# Altium project CamLink.PrjPcb
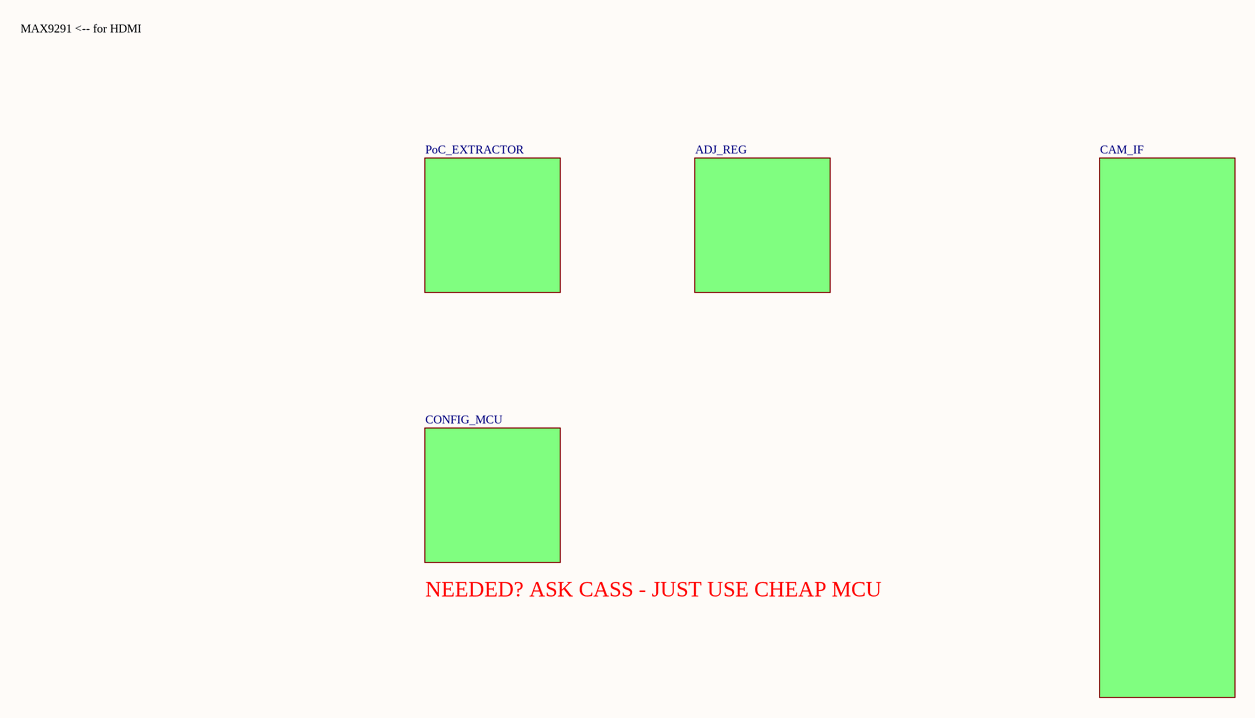
[diagram p0: CamLink.SchDoc]
5 sheets, 3 parts. Net scope: global (net labels, ports and power ports of the same name join across sheets).
Sheets:
  CamLink.SchDoc
    CAM_IF = CAM_IF.SchDoc
    ADJ_REG = ADJ_REG.SchDoc
    PoC_EXTRACTOR = PoC_EXTRACTOR.SchDoc
    CONFIG_MCU = CONFIG_MCU.SchDoc

## Sheet CamLink.SchDoc
size B; SheetNumber: 1; SheetTotal: 5

### Sub-sheets
ADJ_REG = ADJ_REG: no entries
CAM_IF = CAM_IF: no entries
CONFIG_MCU = CONFIG_MCU: no entries
PoC_EXTRACTOR = PoC_EXTRACTOR: no entries

### Notes on the sheet
- MAX9291 <-- for HDMI
- NEEDED? ASK CASS - JUST USE CHEAP MCU

## Sheet CAM_IF.SchDoc
size C; SheetNumber: 2; SheetTotal: 2
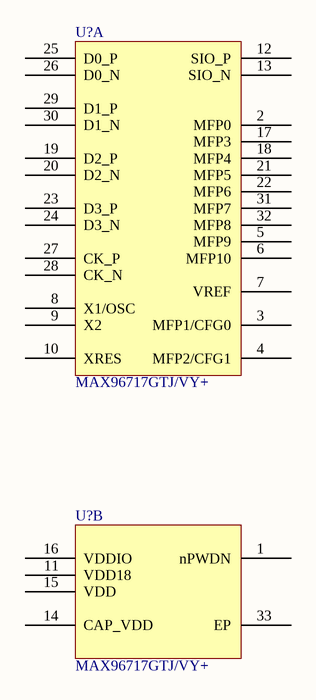
[diagram p1: CAM_IF.SchDoc]

### Parts
(Parts that share a designator on the sheet are numbered #1, #2 ... from top to bottom, then left to right.)
U?#1  MAX96717GTJ/VY+  [PQFN50P500X500X80_HS-33N]  (part A of 2)
U?#2  MAX96717GTJ/VY+  [PQFN50P500X500X80_HS-33N]  (part B of 2)

### Nets

Not connected (* = marked no-connect by the designer): U?#1 2(MFP0) 3(MFP1/CFG0) 4(MFP2/CFG1) 5(MFP9) 6(MFP10) 7(VREF) 8(X1/OSC) 9(X2) 10(XRES) 12(SIO_P) 13(SIO_N) 17(MFP3) 18(MFP4) 19(D2_P) 20(D2_N) 21(MFP5) 22(MFP6) 23(D3_P) 24(D3_N) 25(D0_P) 26(D0_N) 27(CK_P) 28(CK_N) 29(D1_P) 30(D1_N) 31(MFP7) 32(MFP8); U?#2 1(nPWDN) 11(VDD18) 14(CAP_VDD) 15(VDD) 16(VDDIO) 33(EP)

### Library data of the parts
U?#1 U?#2 = CMP-015-00013-1: GMSL2 Compact Serializer

## Sheet ADJ_REG.SchDoc
size A4; SheetNumber: 3; SheetTotal: 3
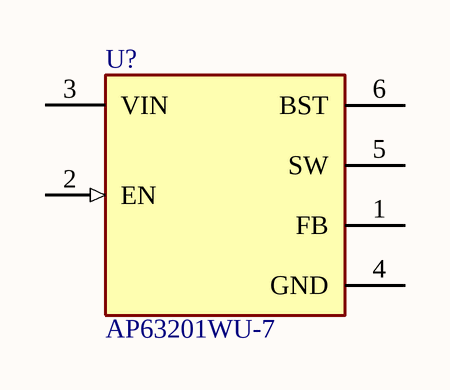
[diagram p2: ADJ_REG.SchDoc]

### Parts
(Parts that share a designator on the sheet are numbered #1, #2 ... from top to bottom, then left to right.)
U?#3  AP63201WU-7  [FP-TSOT26-MFG]

### Nets

Not connected (* = marked no-connect by the designer): U?#3 1(FB) 2(EN) 3(VIN) 4(GND) 5(SW) 6(BST)

### Library data of the parts
U?#3 = CMP-12757-000019-1: IC REG BUCK ADJUSTABLE 2A TSOT26

## Sheet PoC_EXTRACTOR.SchDoc
size A4; SheetNumber: 4; SheetTotal: 4

## Sheet CONFIG_MCU.SchDoc
size A4; SheetNumber: 5; SheetTotal: 5